# EAGLE schematic Sensorenschakeling_schema (EAGLE 9.7.0)
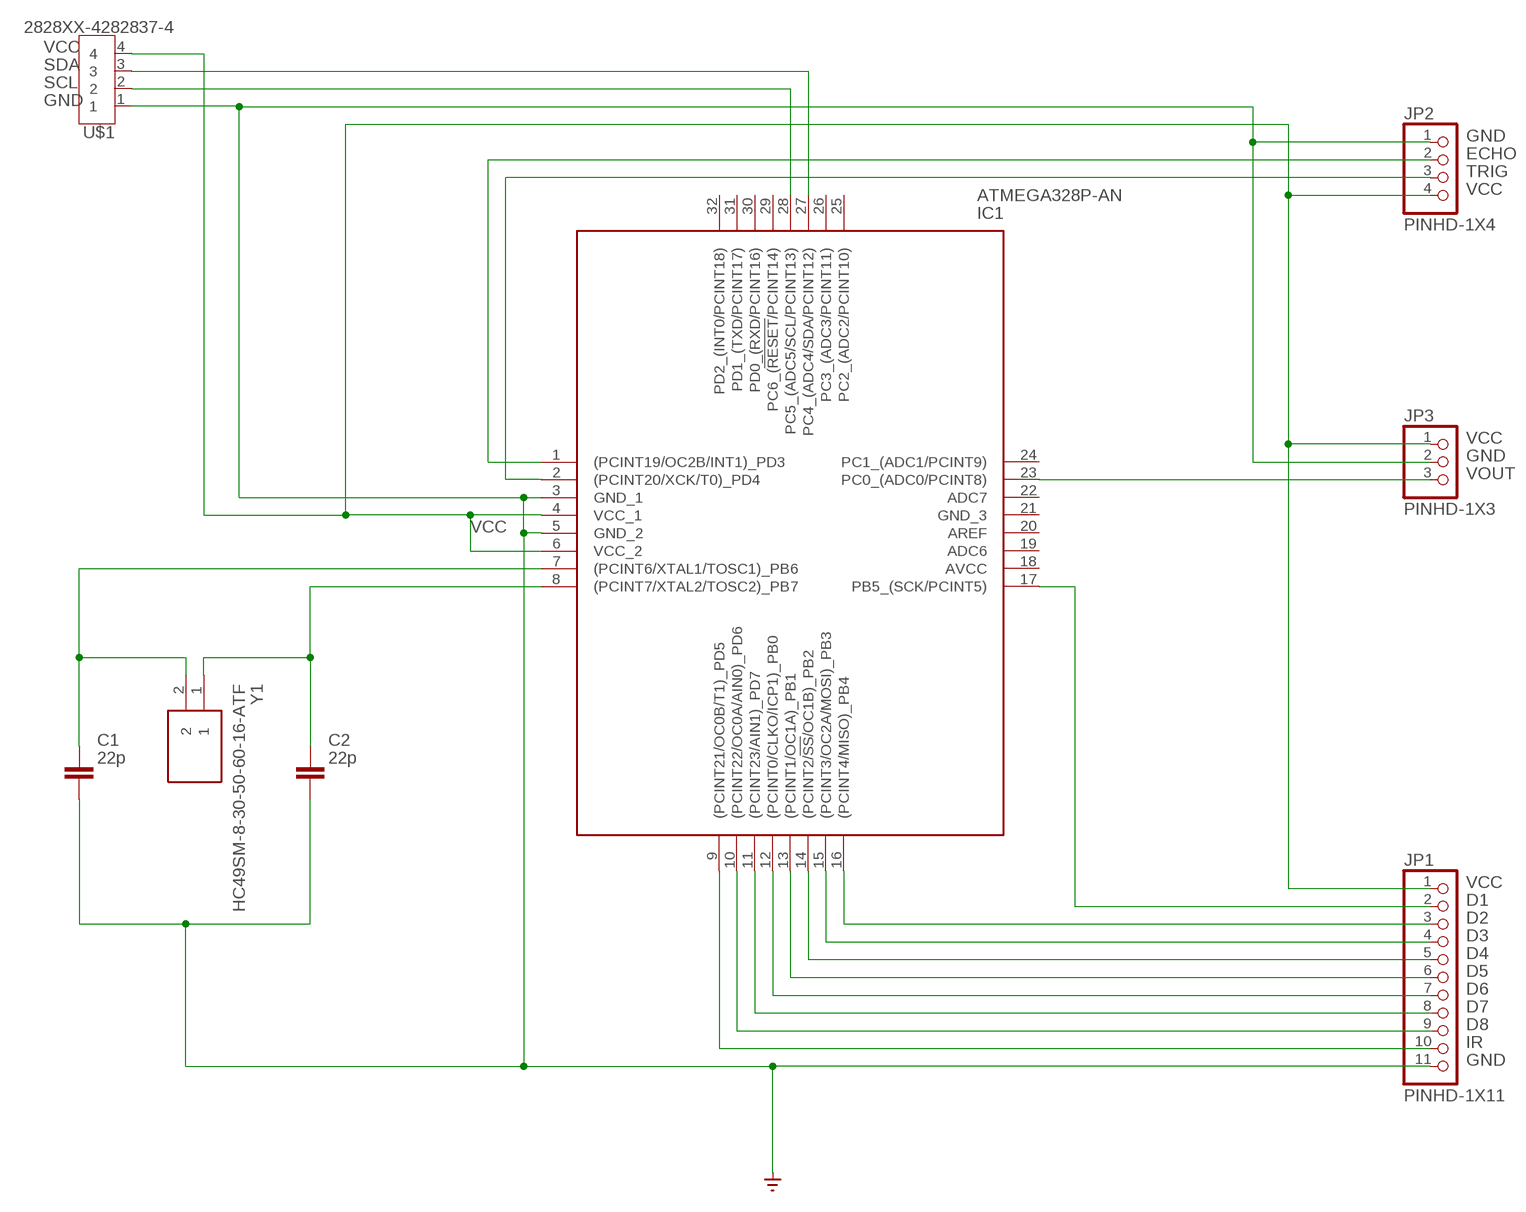
[diagram p0: schematic, sheet 1]

## Parts
C1  22p  C_CHIP-0805(2012-METRIC)  [CAPC2012X110]
C2  22p  C_CHIP-0805(2012-METRIC)  [CAPC2012X110]
IC1  ATMEGA328P-AN  [QFP80P900X900X120-32N]
JP1  PINHD-1X11  [1X11]
JP2  PINHD-1X4  [1X04]
JP3  PINHD-1X3  [1X03]
U$1  2828XX-4282837-4  [TERMBLK_508-4N]
Y1  HC49SM-8-30-50-60-16-ATF  [HC49SM830506016ATF]

## Nets
D1: IC1.17(PB5_(SCK/PCINT5)) JP1.2
D2: IC1.16((PCINT4/MISO)_PB4) JP1.3
D3: IC1.15((PCINT3/OC2A/MOSI)_PB3) JP1.4
D4: IC1.14((PCINT2/!SS!/OC1B)_PB2) JP1.5
D5: IC1.13((PCINT1/OC1A)_PB1) JP1.6
D6: IC1.12((PCINT0/CLKO/ICP1)_PB0) JP1.7
D7: IC1.11((PCINT23/AIN1)_PD7) JP1.8
D8: IC1.10((PCINT22/OC0A/AIN0)_PD6) JP1.9
ECHO: IC1.1((PCINT19/OC2B/INT1)_PD3) JP2.2
GND: C1.2 C2.2 IC1.3(GND_1) IC1.5(GND_2) JP1.11 JP2.1 JP3.2 U$1.1 ; supply symbol labelled SUPPLY0_GND_
IR: IC1.9((PCINT21/OC0B/T1)_PD5) JP1.10
N$1: C1.1 IC1.7((PCINT6/XTAL1/TOSC1)_PB6) Y1.2
N$2: C2.1 IC1.8((PCINT7/XTAL2/TOSC2)_PB7) Y1.1
SCL: IC1.28(PC5_(ADC5/SCL/PCINT13)) U$1.2
SDA: IC1.27(PC4_(ADC4/SDA/PCINT12)) U$1.3
TRIG: IC1.2((PCINT20/XCK/T0)_PD4) JP2.3
VCC: IC1.4(VCC_1) IC1.6(VCC_2) JP1.1 JP2.4 JP3.1 U$1.4
VOUT: IC1.23(PC0_(ADC0/PCINT8)) JP3.3
Unconnected: IC1.18(AVCC) IC1.19(ADC6) IC1.20(AREF) IC1.21(GND_3) IC1.22(ADC7) IC1.24(PC1_(ADC1/PCINT9)) IC1.25(PC2_(ADC2/PCINT10)) IC1.26(PC3_(ADC3/PCINT11)) IC1.29(PC6_(!RESET!/PCINT14)) IC1.30(PD0_(RXD/PCINT16)) IC1.31(PD1_(TXD/PCINT17)) IC1.32(PD2_(INT0/PCINT18))

## Library data of the parts
C1 C2 = Capacitor:C: Capacitor - Generic; CATEGORY: Capacitor
IC1 = ATMEGA328P-AN:ATMEGA328P-AN: MCU 8-bit ATmega AVR RISC 32KB Flash Atmel ATMEGA328P-AN, 8bit AVR Microcontroller, 20MHz, 32 kB Flash, 32-Pin TQFP Source: Datasheet <https://datasheet.datasheetarchive.com/originals/distributors/Datasheets_SAMA/81e6b951babeaaddc9de6b0e081ba8bf.pdf>; ARROW_PART_NUMBER: ATMEGA328P-AN; ARROW_PRICE-STOCK: https://www.arrow.com/en/products/atmega328p-an/microchip-technology?region=nac; DESCRIPTION: MCU 8-bit ATmega AVR RISC 32KB Flash Atmel ATMEGA328P-AN, 8bit AVR Microcontroller, 20MHz, 32 kB Flash, 32-Pin TQFP; HEIGHT: 1.2mm; MANUFACTURER_NAME: Microchip; MANUFACTURER_PART_NUMBER: ATMEGA328P-AN; MOUSER_PART_NUMBER: 556-ATMEGA328P-AN; MOUSER_PRICE-STOCK: https://www.mouser.co.uk/ProductDetail/Microchip-Technology-Atmel/ATMEGA328P-AN?qs=6Dg1WZIWLC6WK556tw8xAw%3D%3D
JP1 = Connector:PINHD-1X11: PIN HEADER; CATEGORY: CONNECTOR; SUB-CATEGORY: PIN-HEADER
JP2 = Connector:PINHD-1X4: PIN HEADER; CATEGORY: CONNECTOR; SUB-CATEGORY: PIN-HEADER
JP3 = Connector:PINHD-1X3: PIN HEADER; CATEGORY: CONNECTOR; SUB-CATEGORY: PIN-HEADER
U$1 = Connector:2828XX-4: 4 Position Wire to Board Terminal Block Horizontal with Board Datasheet <https://www.te.com.cn/commerce/DocumentDelivery/DDEController?Action=showdoc&DocId=Catalog+Section%7F1308389_EUROSTYLE_TERMINAL_BLOCKS%7F0607%7Fpdf%7FEnglish%7FENG_CS_1308389_EUROSTYLE_TERMINAL_BLOCKS_0607.pdf%7F2-282837-5>; CATEGORY: Connector; DESCRIPTION: TERM BLK 4P SIDE ENT 5.08mm PCB; MANUFACTURER: TE Connectivity; MPN: 282837-4; OPERATING_TEMPERATURE: 40°C to +105°C; PART_STATUS: Active; ROHS_COMPLIANCE: RoHS Compliant; SERIES: 283737; SUBCATEGORY: Terminal Block; TYPE: Side Wire Entry
Y1 = HC49SM-8-30-50-60-16-ATF:HC49SM-8-30-50-60-16-ATF: MULTICOMP - HC49SM-8-30-50-60-16-ATF - CRYSTAL, 8MHZ, 16PF, SMD Source: Datasheet <http://www.farnell.com/datasheets/1661828.pdf>; DESCRIPTION: MULTICOMP - HC49SM-8-30-50-60-16-ATF - CRYSTAL, 8MHZ, 16PF, SMD; HEIGHT: 4mm; MANUFACTURER_NAME: MULTICOMP; MANUFACTURER_PART_NUMBER: HC49SM-8-30-50-60-16-ATF